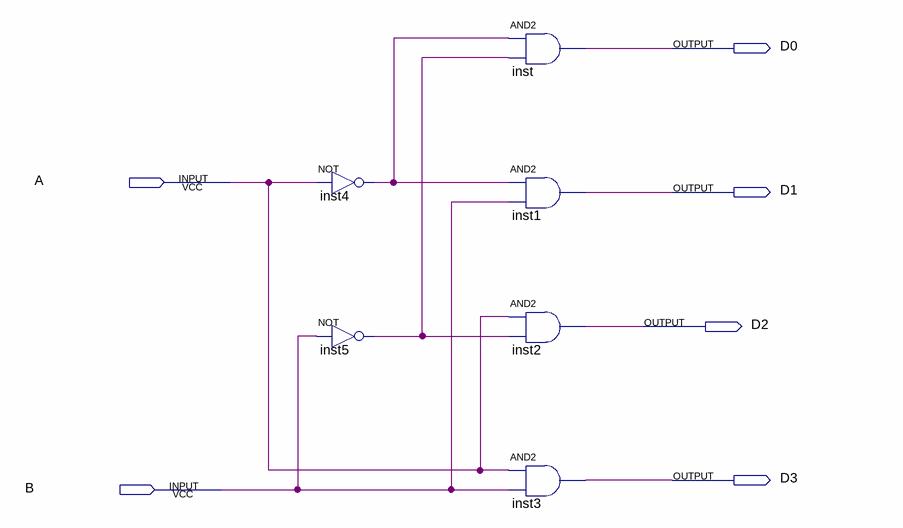
[diagram p0: schematic sheet]
// Quartus schematic lab1_082514.bdf as structural Verilog: 6 symbols, 6 pins
module lab1_082514 (
  input  A,
  input  B,
  output D0,
  output D1,
  output D2,
  output D3
);

  wire inst4_out, inst5_out;

  not inst4 (inst4_out, A);
  not inst5 (inst5_out, B);
  and inst (D0, inst4_out, inst5_out);
  and inst1 (D1, inst4_out, B);
  and inst2 (D2, A, inst5_out);
  and inst3 (D3, A, B);
endmodule
